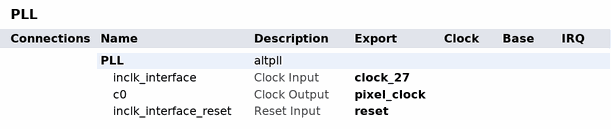
[diagram p0: system contents]
# Platform Designer (Qsys) system PLL, Cyclone II EP2C20F484C7
# Parameters at their usual value, and those the tool derives, are not listed.
package require qsys
create_system PLL
set_project_property DEVICE_FAMILY {Cyclone II}
set_project_property DEVICE EP2C20F484C7

add_instance PLL altpll 13.0
set_instance_parameter_value PLL INCLK0_INPUT_FREQUENCY 37037
set_instance_parameter_value PLL GATE_LOCK_SIGNAL NO
set_instance_parameter_value PLL VALID_LOCK_MULTIPLIER 1
set_instance_parameter_value PLL INVALID_LOCK_MULTIPLIER 5
set_instance_parameter_value PLL CLK0_MULTIPLY_BY 4
set_instance_parameter_value PLL CLK0_DIVIDE_BY 1
set_instance_parameter_value PLL PORT_clk1 PORT_UNUSED
set_instance_parameter_value PLL PORT_clk2 PORT_UNUSED
set_instance_parameter_value PLL PORT_clk3 PORT_UNUSED
set_instance_parameter_value PLL PORT_ARESET PORT_UNUSED
set_instance_parameter_value PLL PORT_LOCKED PORT_UNUSED

# exported interfaces
add_interface clock_27 clock sink
set_interface_property clock_27 EXPORT_OF PLL.inclk_interface
add_interface pixel_clock clock source
set_interface_property pixel_clock EXPORT_OF PLL.c0
add_interface reset reset sink
set_interface_property reset EXPORT_OF PLL.inclk_interface_reset

set_interconnect_requirement {$system} qsys_mm.clockCrossingAdapter HANDSHAKE
set_interconnect_requirement {$system} qsys_mm.maxAdditionalLatency 1

save_system PLL.qsys
